# EAGLE design Sensores_DELANTE_Y_ATRAS (EAGLE 9.0.1)
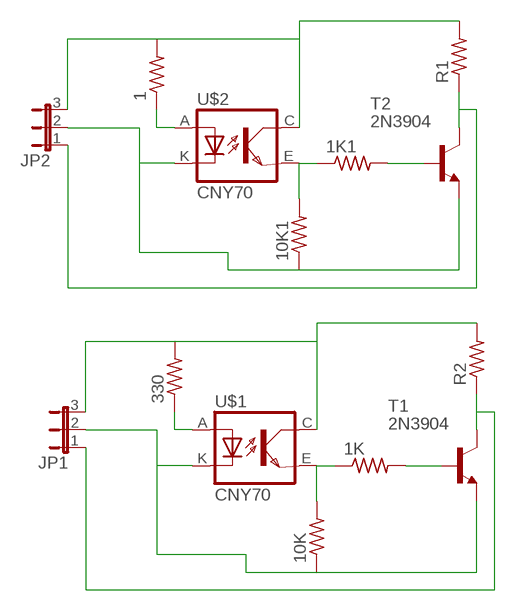
[diagram p0: schematic, sheet 1]

## Parts
1  R-US_0309/10  [0309/10]
1K  R-US_0309/10  [0309/10]
1K1  R-US_0309/10  [0309/10]
10K  R-US_0309/10  [0309/10]
10K1  R-US_0309/10  [0309/10]
330  R-US_0309/10  [0309/10]
JP1  JP2E  [JP2]
JP2  JP2E  [JP2]
R1  R-US_0309/10  [0309/10]
R2  R-US_0309/10  [0309/10]
T1  2N3904  [TO92]
T2  2N3904  [TO92]
U$1  CNY70  [4]
U$2  CNY70  [4]

## Nets
N$1: 330.2 JP1.3 R2.2 U$1.C(COL)
N$2: 10K.1 JP1.2 T1.3(E) U$1.K(C)
N$3: 1K.2 T1.2(B)
N$4: 1K.1 10K.2 U$1.E(EMI)
N$5: 330.1 U$1.A
N$6: JP1.1 R2.1 T1.1(C)
N$7: 1.2 JP2.3 R1.2 U$2.C(COL)
N$8: 10K1.1 JP2.2 T2.3(E) U$2.K(C)
N$9: 1K1.2 T2.2(B)
N$10: 1K1.1 10K1.2 U$2.E(EMI)
N$11: 1.1 U$2.A
N$12: JP2.1 R1.1 T2.1(C)

## Library data of the parts
1 1K 1K1 10K 10K1 330 R1 R2 = rcl:R-US_: RESISTOR, American symbol
JP1 JP2 = jumper:JP2E: JUMPER
T1 T2 = transistor:2N3904: NPN TRANSISTOR
U$1 U$2 = cny70:CNY70

## Board
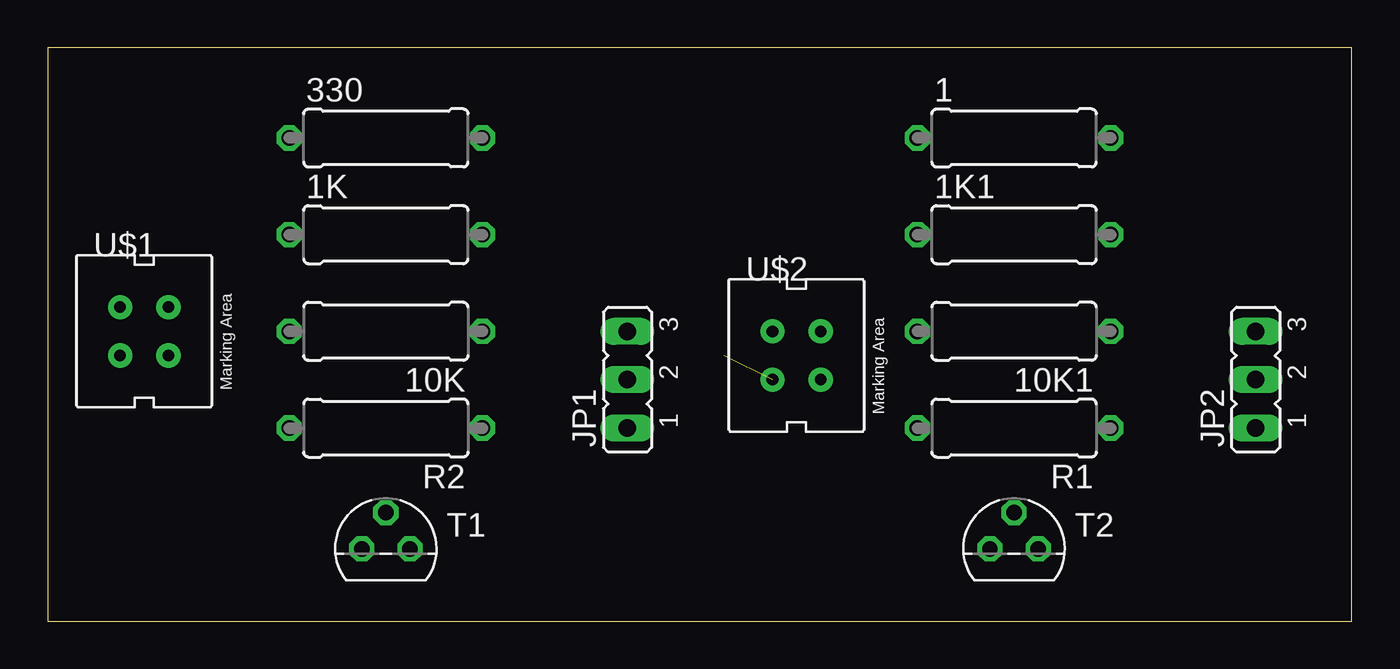
[diagram p1: board, top side]
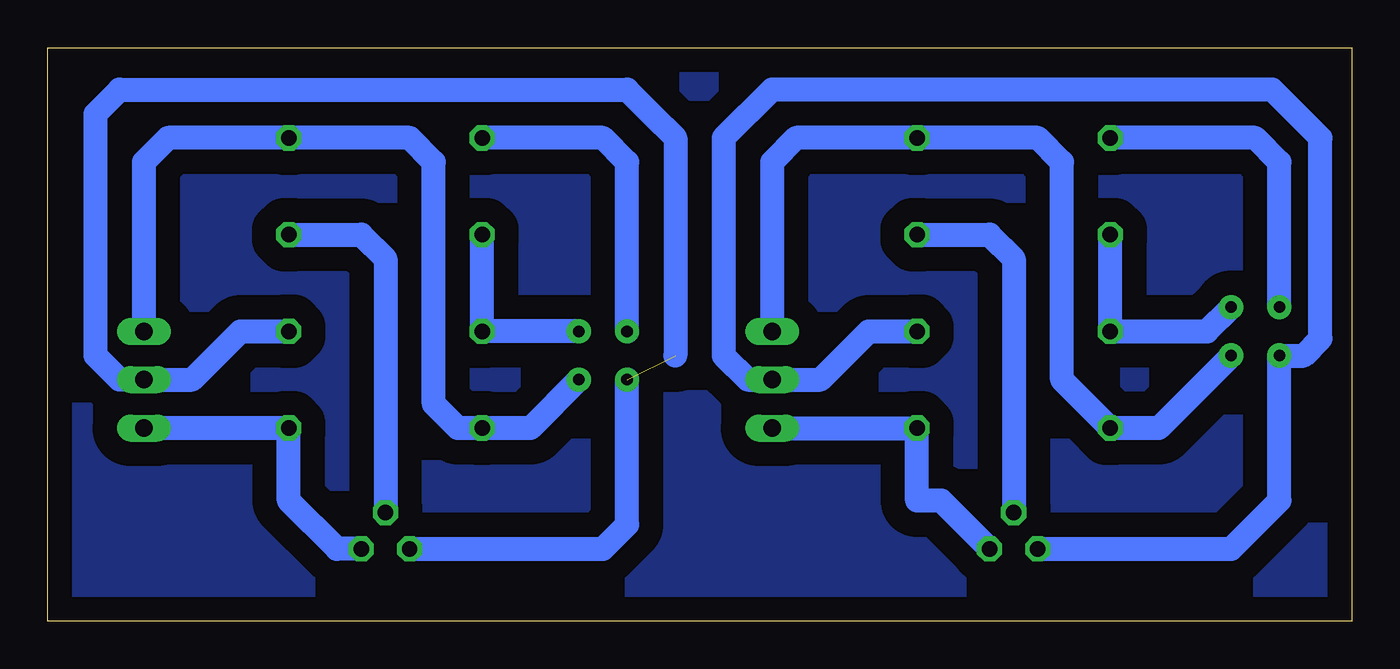
[diagram p2: board, bottom side, seen from below]

Size 68.56 x 30.15 mm. Coordinates in mm from the lower left corner, seen from the top.
Outline: 0,0 68.56,0 68.56,30.15 0,30.15 0,0
Copper layers (1*16): Top 0.035mm / dielectric 1.5mm / Bottom 0.035mm
Design rules "default": minimum track width 6mil, minimum drill 0.35mm, track to track 6mil, track to pad 6mil, pad to pad 6mil, via to via 6mil, smd to smd 6mil, copper to edge 40mil, drill to drill 6mil, minimum pad ring 10mil, minimum via ring 8mil, stop-mask expansion 4mil, vias tented up to drill 0mil, thermal gap 10mil

### Footprints (pad centres in the part's own frame; a part is rotated, then mirrored left to right if it is on the bottom)
0309/10 = drill 0.813 octagon: 1 -5.08,0; 2 5.08,0
JP2 = drill 0.914 long: 1 -2.54,0; 2 0,0; 3 2.54,0
TO92 = drill 0.813 octagon: 1 1.27,0; 2 0,1.905; 3 -1.27,0
4 = drill 0.61 pad 1.27: A -1.27,1.27; C 1.27,-1.27; E 1.27,1.27; K -1.27,-1.27

### Placement (x,y rotation side)
1  50.8,25.4 0 top
1K  17.78,20.32 0 top
1K1  50.8,20.32 0 top
10K  17.78,15.24 180 top
10K1  50.8,15.24 180 top
330  17.78,25.4 0 top
JP1  30.48,12.7 90 top
JP2  63.5,12.7 90 top
R1  50.8,10.16 180 top
R2  17.78,10.16 180 top
T1  17.78,3.81 0 top
T2  50.8,3.81 0 top
U$1  5.08,15.24 0 top
U$2  39.37,13.97 0 top

### Tracks (layer width: path | path; a pad name or v marks a point on that pad's centre or on a via)
N$1
  Bottom 1.27: U$1.C 10.16,10.16 R2.2 15.24,12.7 15.24,24.13 16.51,25.4 330.2 29.21,25.4 30.48,24.13 JP1.3
N$2
  Bottom 1.27: 10K.1 25.4,15.24 27.94,12.7 JP1.2 31.75,12.7 33.02,13.97 33.02,25.4 30.48,27.94 4.19,27.94 1.65,25.4 1.65,14.86 2.54,13.97 U$1.K 3.81,6.35 6.35,3.81 T1.3
N$3
  Bottom 1.27: 1K.2 19.05,20.32 17.78,19.05 T1.2
N$4
  Bottom 1.27: 1K.1 10K.2 7.62,15.24 U$1.E
N$5
  Bottom 1.27: U$1.A 3.81,24.13 5.08,25.4 330.1
N$6
  Bottom 1.27: JP1.1 R2.1 22.86,6.35 21.59,6.35 T1.1
N$7
  Bottom 1.27: U$2.C 43.18,10.16 R1.2 46.99,10.16 48.26,11.43 48.26,24.13 49.53,25.4 1.2 62.23,25.4 63.5,24.13 JP2.3
N$8  (1 unrouted)
  Bottom 1.27: 10K1.1 58.42,15.24 60.96,12.7 JP2.2 64.77,12.7 66.04,13.97 66.04,24.13 66.04,26.67 64.77,27.94 38.1,27.94 36.83,26.67 35.56,25.4 35.56,13.97 | U$2.K 38.1,5.08 39.37,3.81 T2.3
N$9
  Bottom 1.27: 1K1.2 52.07,20.32 50.8,19.05 T2.2
N$10
  Bottom 1.27: 1K1.1 10K1.2 U$2.E
N$11
  Bottom 1.27: U$2.A 38.1,24.13 39.37,25.4 1.1
N$12
  Bottom 1.27: T2.1 53.34,3.81 55.88,6.35 R1.1 JP2.1
N$13
  pour Bottom (isolate 1.27): 0,30.48 0,0 68.58,0 68.58,30.48